# Altium schematic sheet Sheet1.SchDoc
size A3
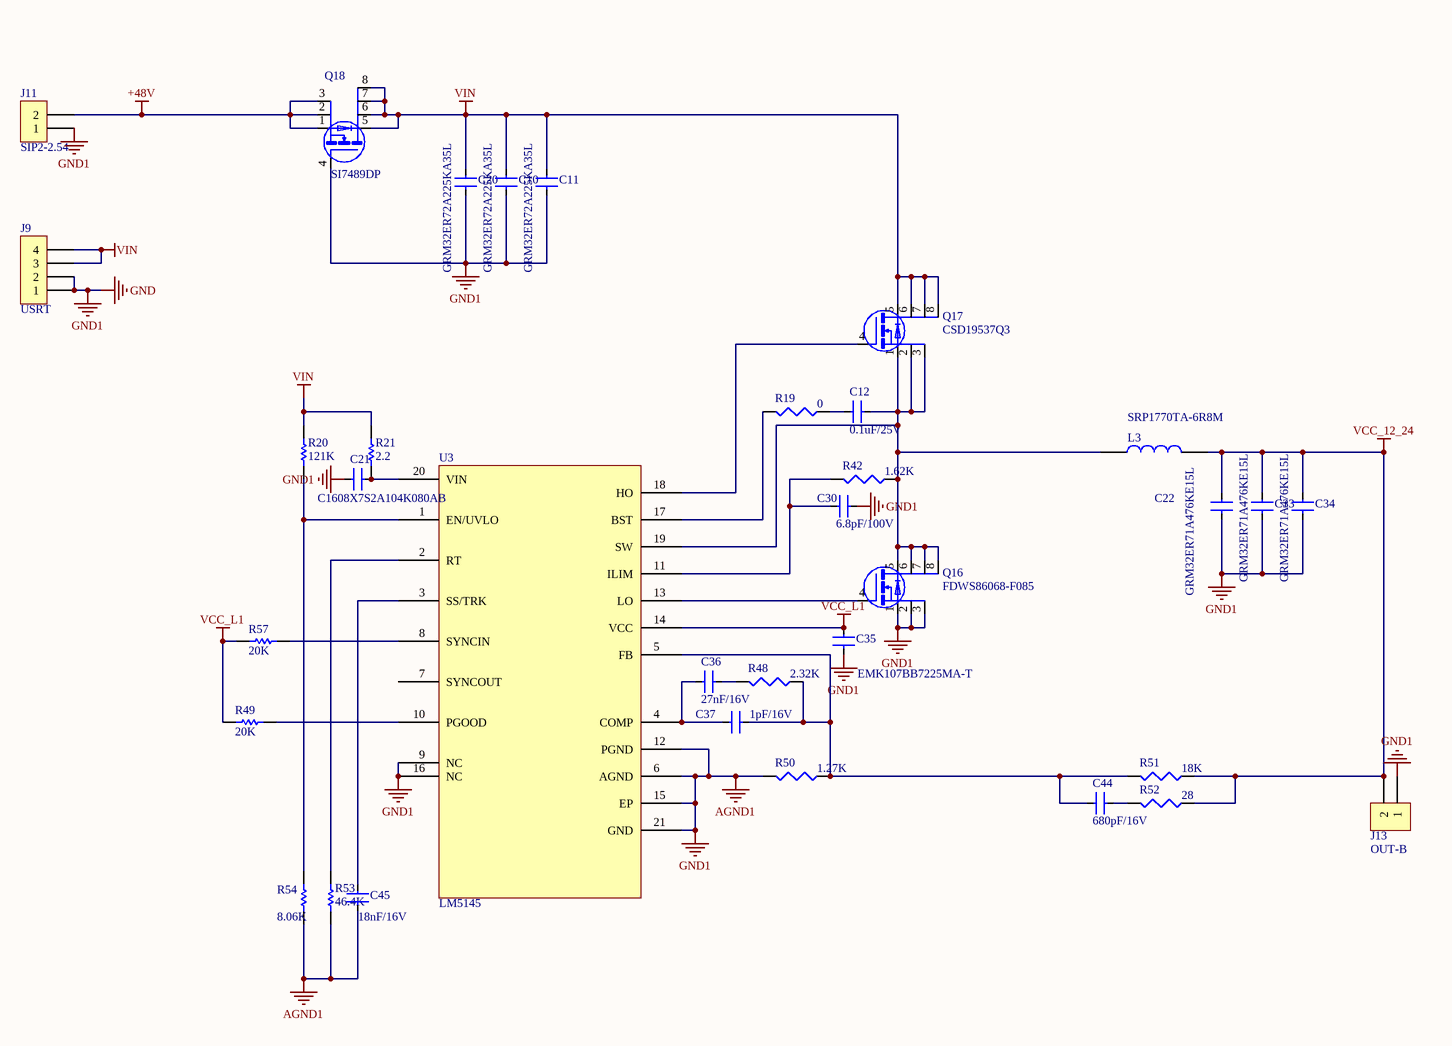
[diagram p0: Sheet1.SchDoc]

## Parts
C10  GRM32ER72A225KA35L  [1210C]
C11  GRM32ER72A225KA35L  [1210C]
C12  0.1uF/25V  [0603C]
C20  GRM32ER72A225KA35L  [1210C]
C21  C1608X7S2A104K080AB  [0603C]
C22  GRM32ER71A476KE15L  [1210C]
C30  6.8pF/100V  [0603C]
C33  GRM32ER71A476KE15L  [1210C]
C34  GRM32ER71A476KE15L  [1210C]
C35  EMK107BB7225MA-T  [0603C]
C36  27nF/16V  [0603C]
C37  1pF/16V  [0603C]
C44  680pF/16V  [0603C]
C45  18nF/16V  [0603C]
J9  USRT  [SIP-4L]
J11  SIP2-2.54  [CH3.96-2P]
J13  OUT-B  [CH3.96-2P]
L3  SRP1770TA-6R8M  [SRP1270-2R2M]
Q16  FDWS86068-F085  [PowerPAK SO-8]
Q17  CSD19537Q3  [PowerPAK SO-8]
Q18  SI7489DP  [PowerPAK SO-8]
R19  0  [0603R]
R20  121K  [0805R]
R21  2.2  [0603R]
R42  1.62K  [0603R]
R48  2.32K  [0603R]
R49  20K  [0603R]
R50  1.27K  [0603R]
R51  18K  [0603R]
R52  28  [0603R]
R53  46.4K  [0603R]
R54  8.06K  [0603R]
R57  20K  [0603R]
U3  LM5145  [QFN050P600-8N]

## Nets
+48V: J11.2 Q18.1(S) Q18.2(S) Q18.3(S)
AGND1: C10.2 C11.2 C20.2 C21.1 C22.2 C30.1 C33.2 C34.2 C35.2 C45.2 J9.1 J9.2 J11.1 J13.1 Q16.1(S) Q16.2(S) Q16.3(S) Q18.4(G) R50.2 R53.1 R54.1 U3.6(AGND) U3.9(NC) U3.12(PGND) U3.15(EP) U3.16(NC) U3.21(GND)  [also labelled GND, GND1]
VCC_12_24: C22.1 C33.1 C34.1 J13.2 L3.2 R51.1 R52.1
VCC_L1: C35.1 R49.2 R57.2 U3.14(VCC)
VIN: C10.1 C11.1 C20.1 J9.3 J9.4 Q17.5(D) Q17.6(D) Q17.7(D) Q17.8(D) Q18.5(D) Q18.6(D) Q18.7(D) Q18.8(D) R20.2 R21.1
NetC12_1: C12.1 R19.1
NetC12_2: C12.2 L3.1 Q16.5(D) Q16.6(D) Q16.7(D) Q16.8(D) Q17.1(S) Q17.2(S) Q17.3(S) R42.1 U3.19(SW)
NetC21_2: C21.2 R21.2 U3.20(VIN)
NetC30_2: C30.2 R42.2 U3.11(ILIM)
NetC36_1: C36.1 C37.1 U3.4(COMP)
NetC36_2: C36.2 R48.2
NetC37_2: C37.2 C44.1 R48.1 R50.1 R51.2 U3.5(FB)
NetC44_2: C44.2 R52.2
NetC45_1: C45.1 U3.3(SS/TRK)
NetQ16_4: Q16.4(G) U3.13(LO)
NetQ17_4: Q17.4(G) U3.18(HO)
NetR19_2: R19.2 U3.17(BST)
NetR20_1: R20.1 R54.2 U3.1(EN/UVLO)
NetR49_1: R49.1 U3.10(PGOOD)
NetR53_2: R53.2 U3.2(RT)
NetR57_1: R57.1 U3.8(SYNCIN)

Not connected (* = marked no-connect by the designer): U3 7(SYNCOUT)

## Library data of the parts
C10-C12 C20-C22 C30 C33-C37 C44 C45 = 0.01UF: CCX85-103
J9 = SIP4-2.54: CN-SIP4-2.54
J11 = SIP2-2.54: CN-SIP2-2.54
J13 = CON2: Connector
L3 = INDUCTOR
Q16-Q18 = Si4004DY
R19 R42 R48 R50-R52 = Res3: Resistor; Published: 8-Jun-2000; LatestRevisionDate: 29-May-2009; LatestRevisionNote: IPC-7351 Footprint Added.; PackageReference: J1-0603; Publisher: Altium Limited; PackageDescription: Chip Resistor
R20 R21 R49 R53 R54 R57 = Res Semi: Semiconductor Resistor; Value: 1K; Published: 8-Jun-2000; LatestRevisionDate: 17-Jul-2002; LatestRevisionNote: Re-released for DXP Platform.; PackageReference: AXIAL-0.5; Publisher: Altium Limited